# Altium schematic sheet 28.SchDoc
size 513 x 386 mm
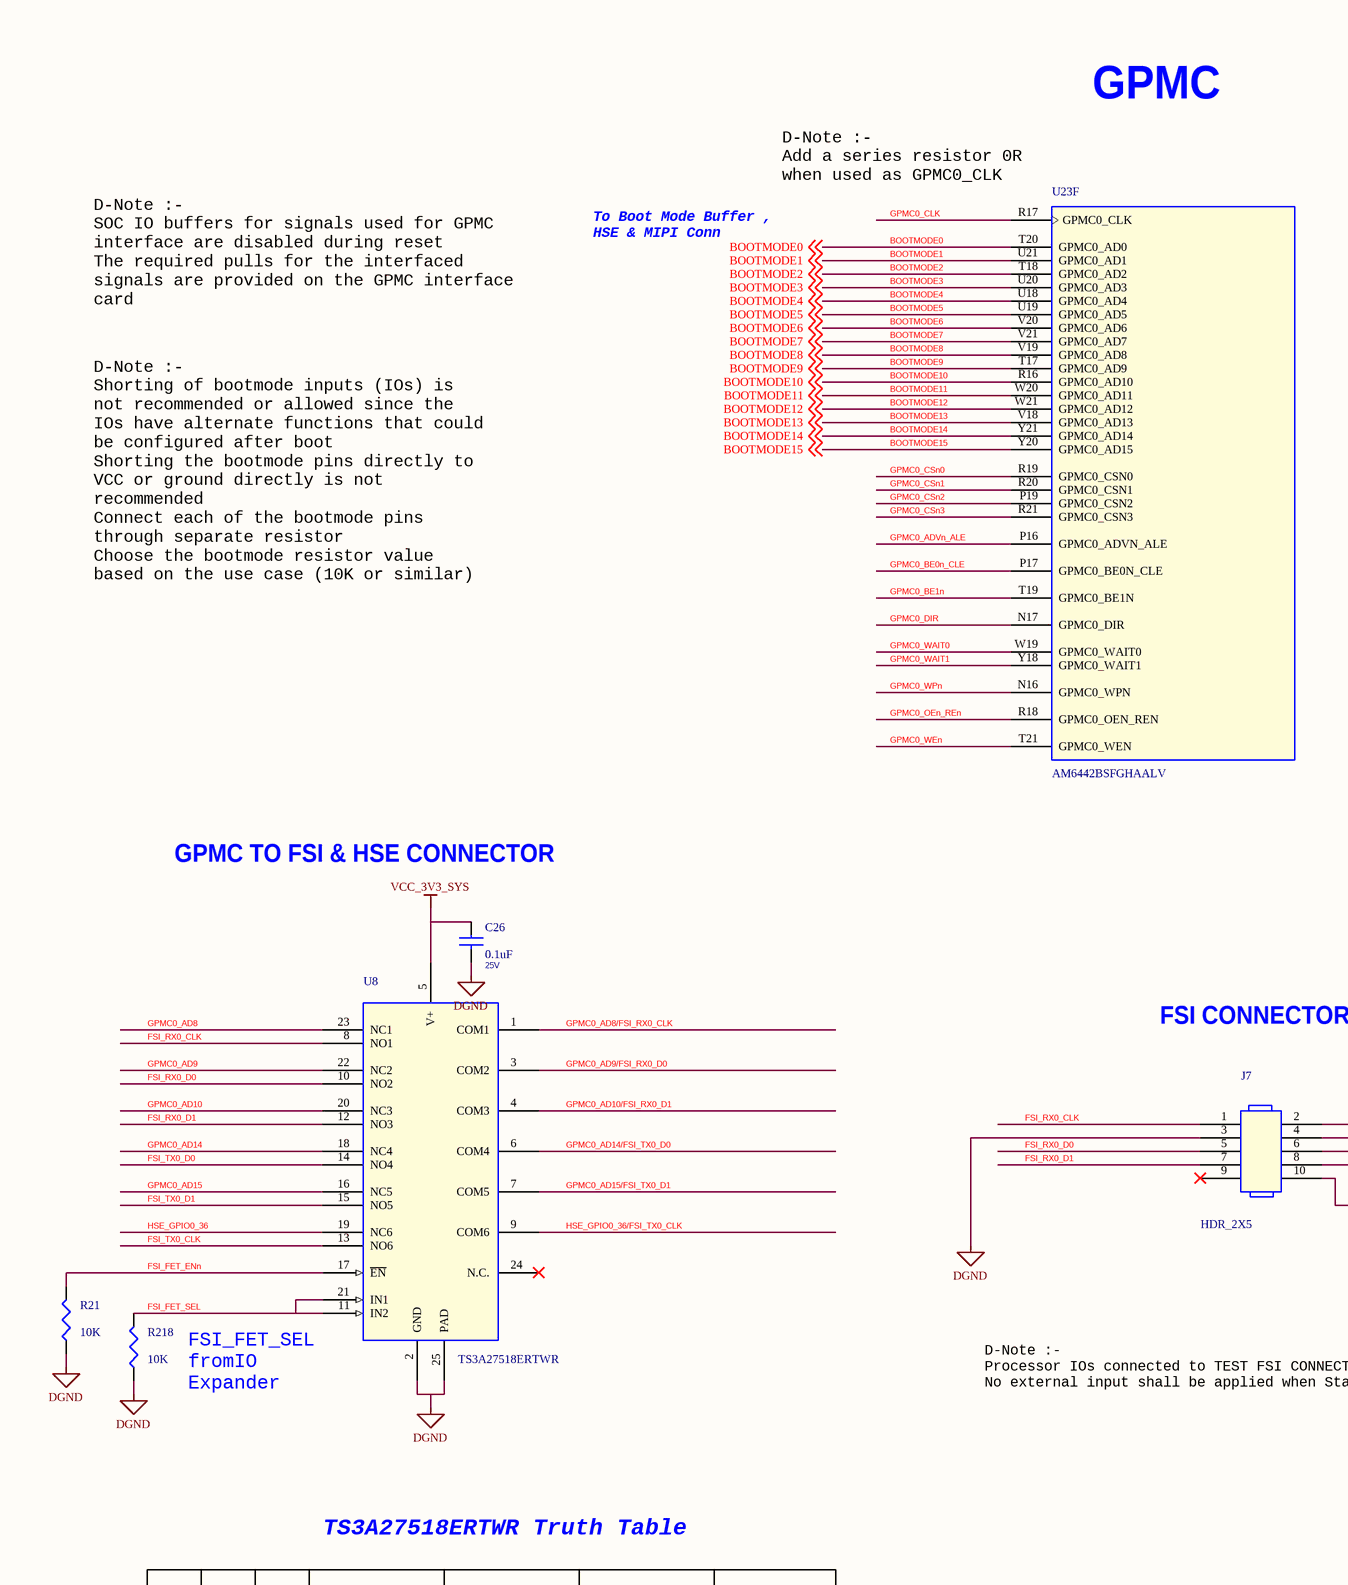
[diagram p0: 28.SchDoc, top left]
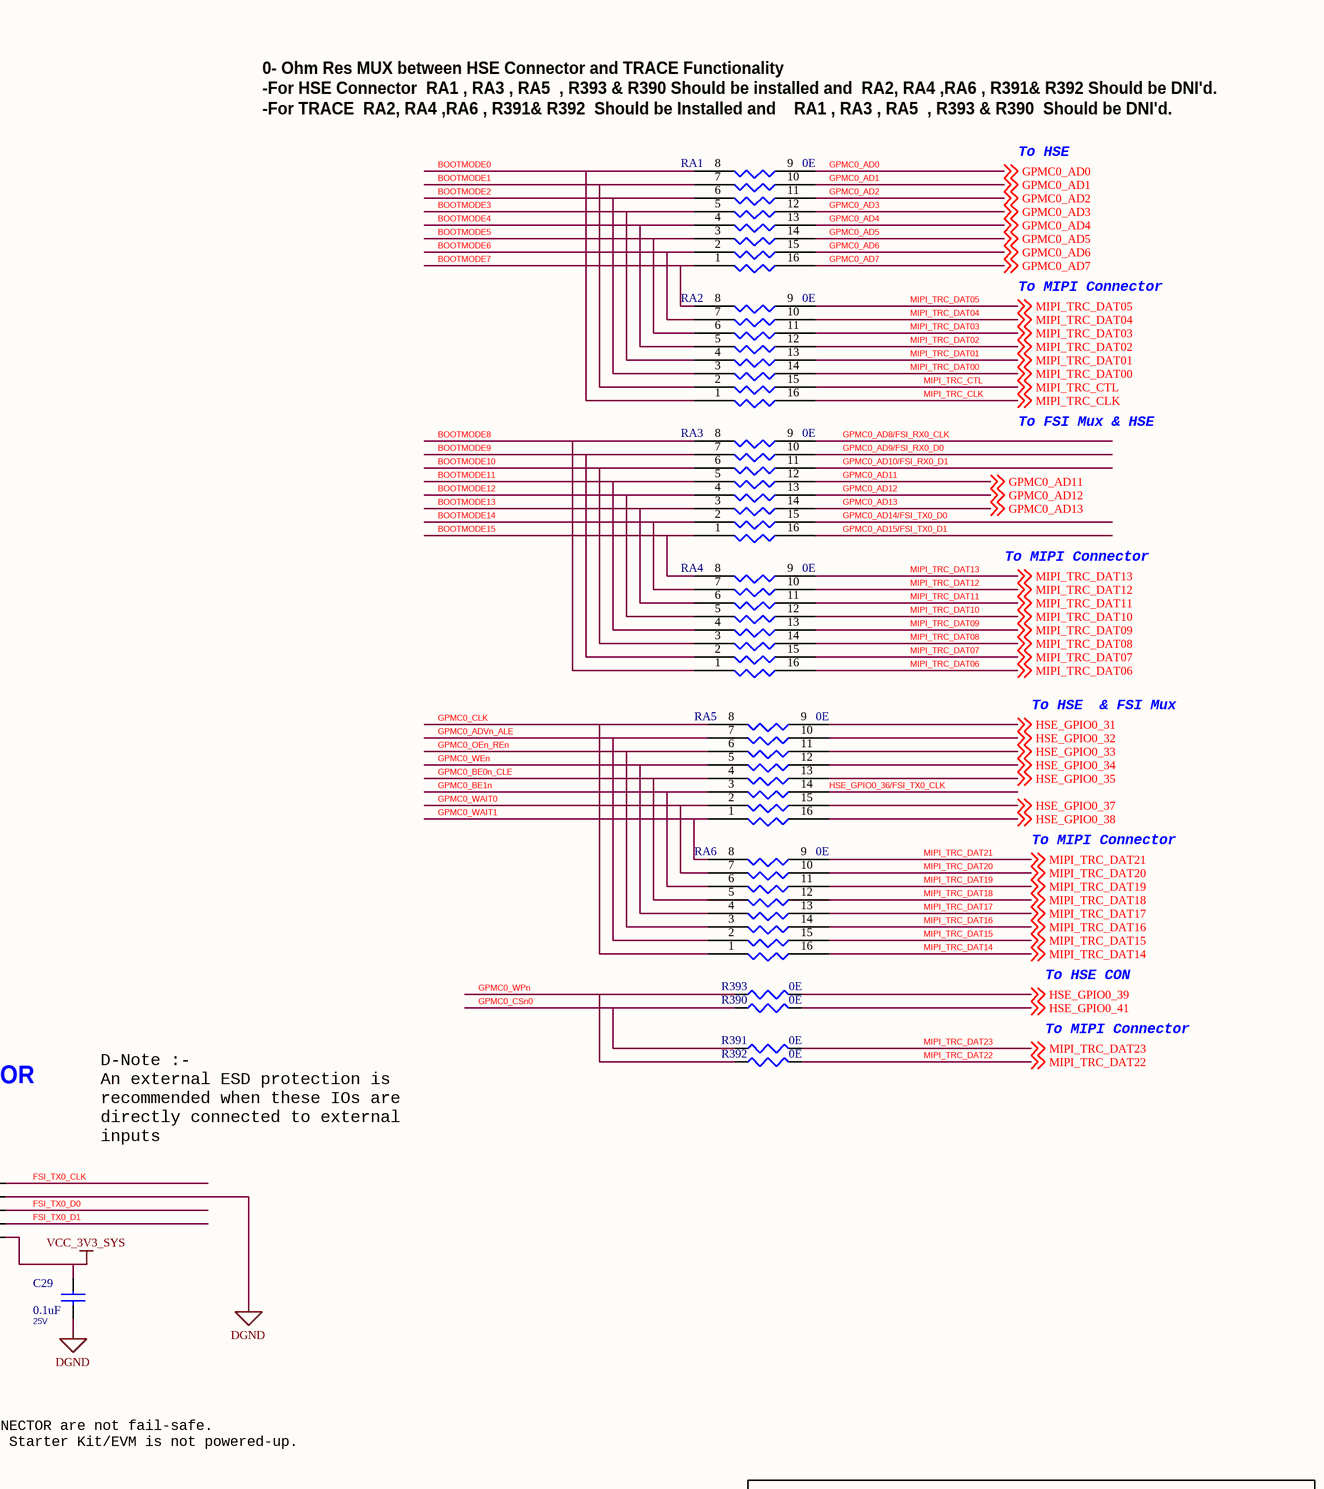
[diagram p1: 28.SchDoc, top right]
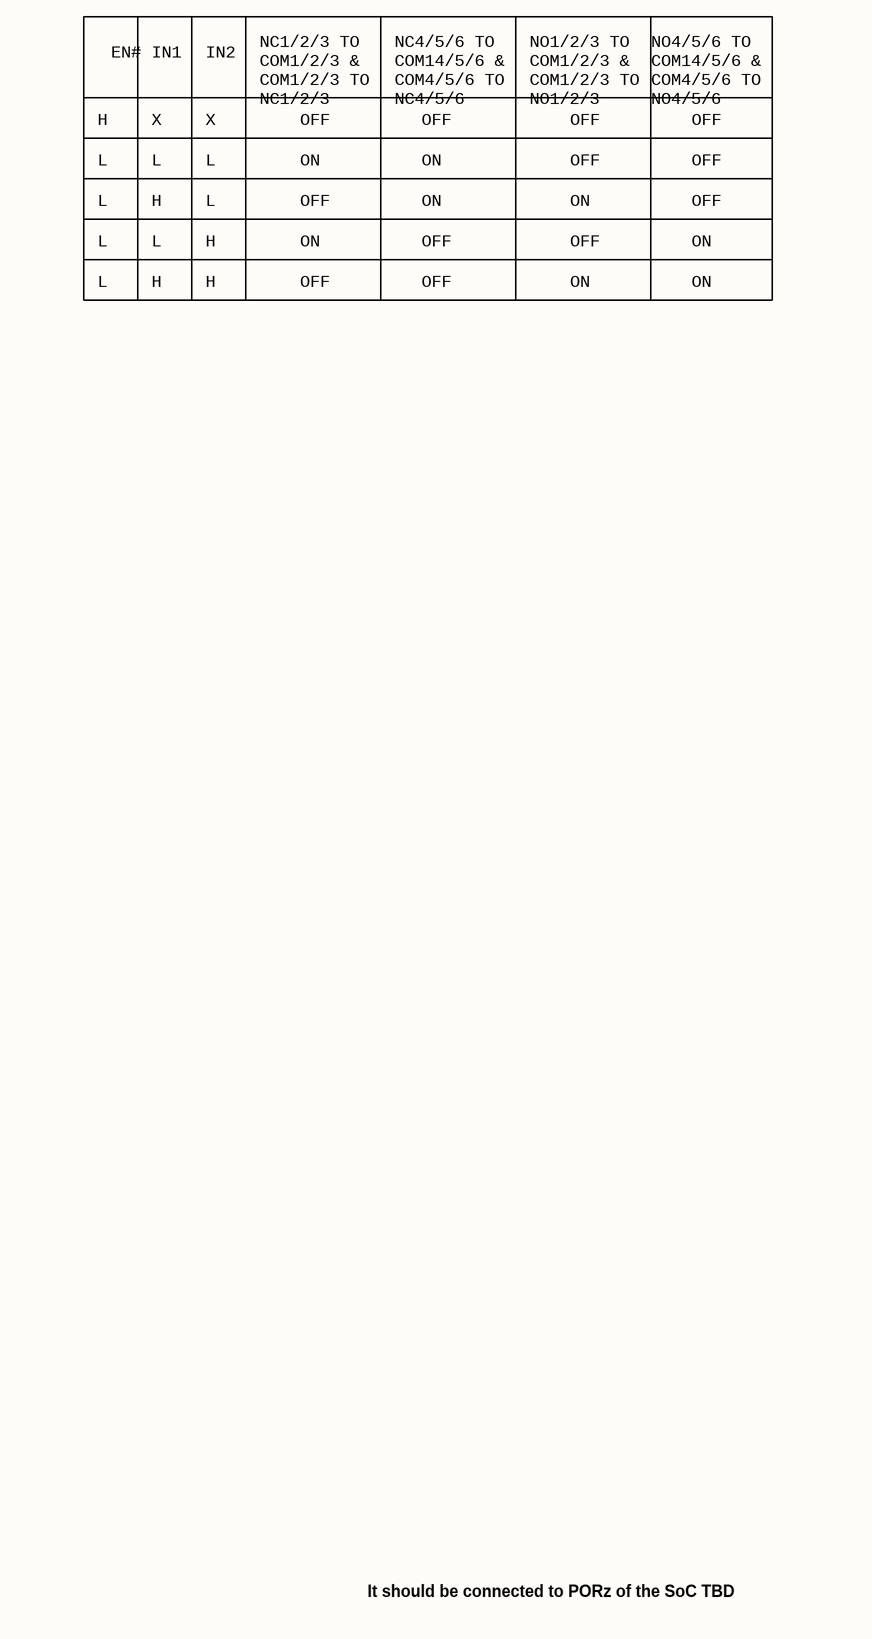
[diagram p2: 28.SchDoc, bottom left]
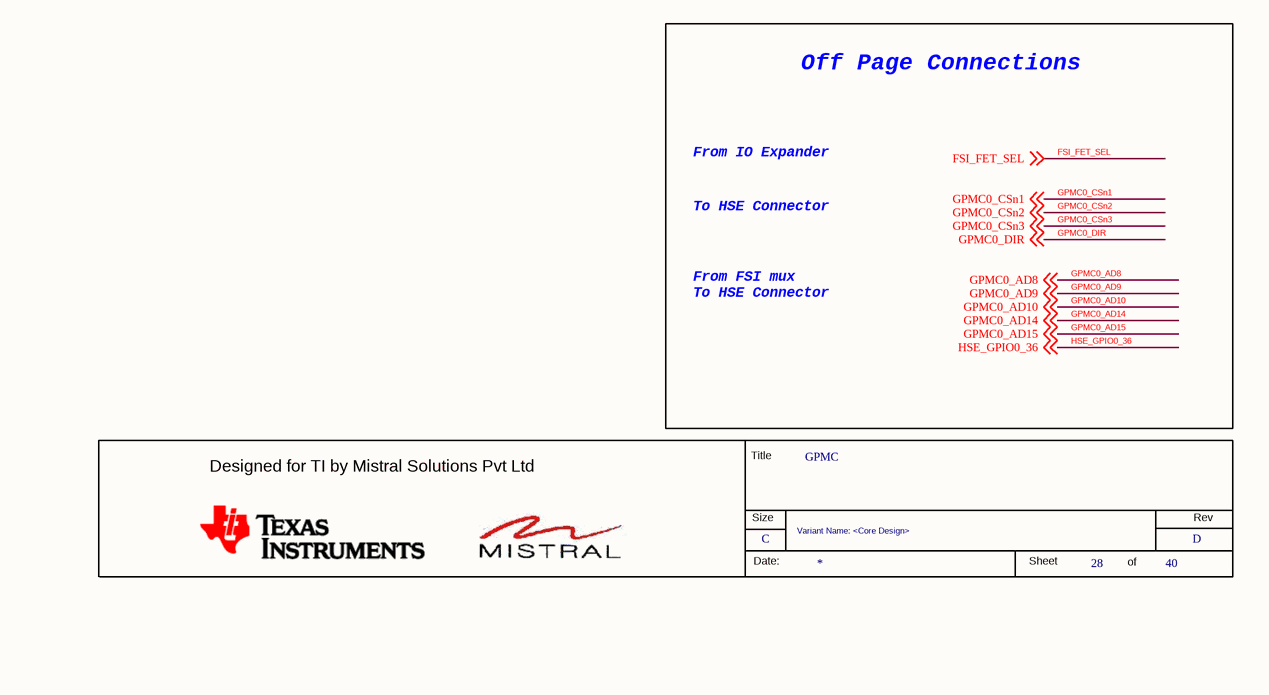
[diagram p3: 28.SchDoc, bottom right]

## Parts
*  RevCode: D  Title: GPMC  Page Size: C  Page Number: 28  Page Count: 40  Variant Name: <Core Design>  (hidden comment: MISTRAL_TITLEBLK_CSIZE)  (graphical)
C26  0.1uF  Voltage: 25V  [CAP0402_0-75]
C29  0.1uF  Voltage: 25V  [CAP0402_0-75]
J7  HDR_2X5  [HDR_5X2_100_S_T_8-6]
R21  10K  [RES0402_0-5]
R218  10K  [RES0402_0-5]
R390  0E  [RES0402_0-5]
R391  0E  [RES0402_0-5]
R392  0E  [RES0402_0-5]
R393  0E  [RES0402_0-5]
RA1  0E  [RESA_EXB2HV_0602-8_0-6]
RA2  0E  [RESA_EXB2HV_0602-8_0-6]
RA3  0E  [RESA_EXB2HV_0602-8_0-6]
RA4  0E  [RESA_EXB2HV_0602-8_0-6]
RA5  0E  [RESA_EXB2HV_0602-8_0-6]
RA6  0E  [RESA_EXB2HV_0602-8_0-6]
U8  TS3A27518ERTWR  [QFN24_19-68_160X160_0-8]
U23  AM6442BSFGHAALV  [FCBGA441_31-49_680X680_2-6]  (part F of 16)

## Nets
DGND: C26.2 C29.2 J7.3 J7.4 R21.2 R218.2 U8.2(GND) U8.25(PAD)
VCC_3V3_SYS: C26.1 C29.1 J7.10 U8.5(V+)
BOOTMODE0: RA1.8 RA2.1 U23.T20(GPMC0_AD0) ; off-sheet BOOTMODE0
BOOTMODE1: RA1.7 RA2.2 U23.U21(GPMC0_AD1) ; off-sheet BOOTMODE1
BOOTMODE2: RA1.6 RA2.3 U23.T18(GPMC0_AD2) ; off-sheet BOOTMODE2
BOOTMODE3: RA1.5 RA2.4 U23.U20(GPMC0_AD3) ; off-sheet BOOTMODE3
BOOTMODE4: RA1.4 RA2.5 U23.U18(GPMC0_AD4) ; off-sheet BOOTMODE4
BOOTMODE5: RA1.3 RA2.6 U23.U19(GPMC0_AD5) ; off-sheet BOOTMODE5
BOOTMODE6: RA1.2 RA2.7 U23.V20(GPMC0_AD6) ; off-sheet BOOTMODE6
BOOTMODE7: RA1.1 RA2.8 U23.V21(GPMC0_AD7) ; off-sheet BOOTMODE7
BOOTMODE8: RA3.8 RA4.1 U23.V19(GPMC0_AD8) ; off-sheet BOOTMODE8
BOOTMODE9: RA3.7 RA4.2 U23.T17(GPMC0_AD9) ; off-sheet BOOTMODE9
BOOTMODE10: RA3.6 RA4.3 U23.R16(GPMC0_AD10) ; off-sheet BOOTMODE10
BOOTMODE11: RA3.5 RA4.4 U23.W20(GPMC0_AD11) ; off-sheet BOOTMODE11
BOOTMODE12: RA3.4 RA4.5 U23.W21(GPMC0_AD12) ; off-sheet BOOTMODE12
BOOTMODE13: RA3.3 RA4.6 U23.V18(GPMC0_AD13) ; off-sheet BOOTMODE13
BOOTMODE14: RA3.2 RA4.7 U23.Y21(GPMC0_AD14) ; off-sheet BOOTMODE14
BOOTMODE15: RA3.1 RA4.8 U23.Y20(GPMC0_AD15) ; off-sheet BOOTMODE15
FSI_FET_ENn: R21.1 U8.17(~{EN})
FSI_FET_SEL: R218.1 U8.11(IN2) U8.21(IN1) ; off-sheet FSI_FET_SEL
FSI_RX0_CLK: J7.1 U8.8(NO1)
FSI_RX0_D0: J7.5 U8.10(NO2)
FSI_RX0_D1: J7.7 U8.12(NO3)
FSI_TX0_CLK: J7.2 U8.13(NO6)
FSI_TX0_D0: J7.6 U8.14(NO4)
FSI_TX0_D1: J7.8 U8.15(NO5)
GPMC0_AD0: RA1.9 ; off-sheet GPMC0_AD0
GPMC0_AD1: RA1.10 ; off-sheet GPMC0_AD1
GPMC0_AD2: RA1.11 ; off-sheet GPMC0_AD2
GPMC0_AD3: RA1.12 ; off-sheet GPMC0_AD3
GPMC0_AD4: RA1.13 ; off-sheet GPMC0_AD4
GPMC0_AD5: RA1.14 ; off-sheet GPMC0_AD5
GPMC0_AD6: RA1.15 ; off-sheet GPMC0_AD6
GPMC0_AD7: RA1.16 ; off-sheet GPMC0_AD7
GPMC0_AD8: U8.23(NC1) ; off-sheet GPMC0_AD8
GPMC0_AD8/FSI_RX0_CLK: RA3.9 U8.1(COM1)
GPMC0_AD9: U8.22(NC2) ; off-sheet GPMC0_AD9
GPMC0_AD9/FSI_RX0_D0: RA3.10 U8.3(COM2)
GPMC0_AD10: U8.20(NC3) ; off-sheet GPMC0_AD10
GPMC0_AD10/FSI_RX0_D1: RA3.11 U8.4(COM3)
GPMC0_AD11: RA3.12 ; off-sheet GPMC0_AD11
GPMC0_AD12: RA3.13 ; off-sheet GPMC0_AD12
GPMC0_AD13: RA3.14 ; off-sheet GPMC0_AD13
GPMC0_AD14: U8.18(NC4) ; off-sheet GPMC0_AD14
GPMC0_AD14/FSI_TX0_D0: RA3.15 U8.6(COM4)
GPMC0_AD15: U8.16(NC5) ; off-sheet GPMC0_AD15
GPMC0_AD15/FSI_TX0_D1: RA3.16 U8.7(COM5)
GPMC0_ADVn_ALE: RA5.7 RA6.2 U23.P16(GPMC0_ADVN_ALE)
GPMC0_BE0n_CLE: RA5.4 RA6.5 U23.P17(GPMC0_BE0N_CLE)
GPMC0_BE1n: RA5.3 RA6.6 U23.T19(GPMC0_BE1N)
GPMC0_CLK: RA5.8 RA6.1 U23.R17(GPMC0_CLK)
GPMC0_CSn0: R390.1 R391.1 U23.R19(GPMC0_CSN0)
GPMC0_CSn1: U23.R20(GPMC0_CSN1) ; off-sheet GPMC0_CSn1
GPMC0_CSn2: U23.P19(GPMC0_CSN2) ; off-sheet GPMC0_CSn2
GPMC0_CSn3: U23.R21(GPMC0_CSN3) ; off-sheet GPMC0_CSn3
GPMC0_DIR: U23.N17(GPMC0_DIR) ; off-sheet GPMC0_DIR
GPMC0_OEn_REn: RA5.6 RA6.3 U23.R18(GPMC0_OEN_REN)
GPMC0_WAIT0: RA5.2 RA6.7 U23.W19(GPMC0_WAIT0)
GPMC0_WAIT1: RA5.1 RA6.8 U23.Y18(GPMC0_WAIT1)
GPMC0_WEn: RA5.5 RA6.4 U23.T21(GPMC0_WEN)
GPMC0_WPn: R392.1 R393.1 U23.N16(GPMC0_WPN)
HSE_GPIO0_31: RA5.9 ; off-sheet HSE_GPIO0_31
HSE_GPIO0_32: RA5.10 ; off-sheet HSE_GPIO0_32
HSE_GPIO0_33: RA5.11 ; off-sheet HSE_GPIO0_33
HSE_GPIO0_34: RA5.12 ; off-sheet HSE_GPIO0_34
HSE_GPIO0_35: RA5.13 ; off-sheet HSE_GPIO0_35
HSE_GPIO0_36: U8.19(NC6) ; off-sheet HSE_GPIO0_36
HSE_GPIO0_36/FSI_TX0_CLK: RA5.14 U8.9(COM6)
HSE_GPIO0_37: RA5.15 ; off-sheet HSE_GPIO0_37
HSE_GPIO0_38: RA5.16 ; off-sheet HSE_GPIO0_38
HSE_GPIO0_39: R393.2 ; off-sheet HSE_GPIO0_39
HSE_GPIO0_41: R390.2 ; off-sheet HSE_GPIO0_41
MIPI_TRC_CLK: RA2.16 ; off-sheet MIPI_TRC_CLK
MIPI_TRC_CTL: RA2.15 ; off-sheet MIPI_TRC_CTL
MIPI_TRC_DAT00: RA2.14 ; off-sheet MIPI_TRC_DAT00
MIPI_TRC_DAT01: RA2.13 ; off-sheet MIPI_TRC_DAT01
MIPI_TRC_DAT02: RA2.12 ; off-sheet MIPI_TRC_DAT02
MIPI_TRC_DAT03: RA2.11 ; off-sheet MIPI_TRC_DAT03
MIPI_TRC_DAT04: RA2.10 ; off-sheet MIPI_TRC_DAT04
MIPI_TRC_DAT05: RA2.9 ; off-sheet MIPI_TRC_DAT05
MIPI_TRC_DAT06: RA4.16 ; off-sheet MIPI_TRC_DAT06
MIPI_TRC_DAT07: RA4.15 ; off-sheet MIPI_TRC_DAT07
MIPI_TRC_DAT08: RA4.14 ; off-sheet MIPI_TRC_DAT08
MIPI_TRC_DAT09: RA4.13 ; off-sheet MIPI_TRC_DAT09
MIPI_TRC_DAT10: RA4.12 ; off-sheet MIPI_TRC_DAT10
MIPI_TRC_DAT11: RA4.11 ; off-sheet MIPI_TRC_DAT11
MIPI_TRC_DAT12: RA4.10 ; off-sheet MIPI_TRC_DAT12
MIPI_TRC_DAT13: RA4.9 ; off-sheet MIPI_TRC_DAT13
MIPI_TRC_DAT14: RA6.16 ; off-sheet MIPI_TRC_DAT14
MIPI_TRC_DAT15: RA6.15 ; off-sheet MIPI_TRC_DAT15
MIPI_TRC_DAT16: RA6.14 ; off-sheet MIPI_TRC_DAT16
MIPI_TRC_DAT17: RA6.13 ; off-sheet MIPI_TRC_DAT17
MIPI_TRC_DAT18: RA6.12 ; off-sheet MIPI_TRC_DAT18
MIPI_TRC_DAT19: RA6.11 ; off-sheet MIPI_TRC_DAT19
MIPI_TRC_DAT20: RA6.10 ; off-sheet MIPI_TRC_DAT20
MIPI_TRC_DAT21: RA6.9 ; off-sheet MIPI_TRC_DAT21
MIPI_TRC_DAT22: R392.2 ; off-sheet MIPI_TRC_DAT22
MIPI_TRC_DAT23: R391.2 ; off-sheet MIPI_TRC_DAT23

Not connected (* = marked no-connect by the designer): J7 9*; U8 24(N.C.)*

## Notes on the sheet
- 0- Ohm Res MUX between HSE Connector and TRACE Functionality
  -For HSE Connector  RA1 , RA3 , RA5  , R393 & R390 Should be installed and  RA2, RA4 ,RA6 , R391& R392 Should be DNI'd.
  -For TRACE  RA2, RA4 ,RA6 , R391& R392  Should be Installed and    RA1 , RA3 , RA5  , R393 & R390  Should be DNI'd.
- (near U23) D-Note :-
  Add a series resistor 0R
  when used as GPMC0_CLK
- GPMC
- To HSE
- D-Note :-
  SOC IO buffers for signals used for GPMC
  interface are disabled during reset
  The required pulls for the interfaced
  signals are provided on the GPMC interface
  card
- To Boot Mode Buffer ,
  HSE & MIPI Conn
- To MIPI Connector
- D-Note :-
  Shorting of bootmode inputs (IOs) is
  not recommended or allowed since the
  IOs have alternate functions that could
  be configured after boot
  Shorting the bootmode pins directly to
  VCC or ground directly is not
  recommended
  Connect each of the bootmode pins
  through separate resistor
  Choose the bootmode resistor value
  based on the use case (10K or similar)
- To FSI Mux & HSE
- To HSE  & FSI Mux
- GPMC TO FSI & HSE CONNECTOR
- To HSE CON
- D-Note :-
  An external ESD protection is
  recommended when these IOs are
  directly connected to external
  inputs
- FSI CONNECTOR
- (near U8) FSI_FET_SEL
  fromIO
  Expander
- D-Note :-
  Processor IOs connected to TEST FSI CONNECTOR are not fail-safe.
  No external input shall be applied when Starter Kit/EVM is not powered-up.
- Off Page Connections
- TS3A27518ERTWR Truth Table
- EN#
- IN1
- IN2
- NC1/2/3 TO
  COM1/2/3 &
  COM1/2/3 TO
  NC1/2/3
- NC4/5/6 TO
  COM14/5/6 &
  COM4/5/6 TO
  NC4/5/6
- NO1/2/3 TO
  COM1/2/3 &
  COM1/2/3 TO
  NO1/2/3
- NO4/5/6 TO
  COM14/5/6 &
  COM4/5/6 TO
  NO4/5/6
- To HSE Connector
- From IO Expander
- H
- X
- OFF
- From FSI mux
  To HSE Connector
- L
- ON
- It should be connected to PORz of the SoC TBD
- (in symbol MISTRAL_TITLEBLK_CSIZE) Title; Designed for TI by Mistral Solutions Pvt Ltd; Size; Rev; Date:; Sheet; of

## Library data of the parts
* = MISTRAL_TITLEBLK_CSIZE: Issue: 1.0; Page Create Date: March  8, 1995; Page Modify Date: *
C26 C29 = CAP_Dup3: CAP CERAMIC 0.1uF 25V 20% X5R 0402; Alt_Mfr_name: YAGEO AMERICA; Part_type: CAPACITORS\CERAMIC; Mfr_part_number: 885012105018; Mfr_name: WURTH ELECTRONICS; Mistral Part No: 120020080003-R; Alt_Mfr_part_number: CC0402KRX5R8BB104; Custom_Duty: 15%; Customs_HS_Code: 85322990; Wattage: NA; Project: AM64x_EVM_BRD; PCB Footprint: CAP0402_0-75; Footprint Path: Y:\MIS_DATABASE\Library\ALTIUM_TOOL\PCB_FOOTPRINTS\Altium_Footprint_Lib.PcbLib; Library Path: Y:\MIS_DATABASE\Library\ALTIUM_TOOL\SCHEMATICS_PARTS\MS_DISCRETE_Library.schlib; Footprint Ref: CAP0402_0-75; Library Ref: CAP; MECHANICAL 3D STEP FILE: CAP0402_0-75; Chkd/date: MANIRAJA/170820; Crtd /date: ALVY/170820; Datasheet: Y:\MIS_DATABASE\DATASHEETS\CAPACITORS\885012105018.PDF; Temperature: -55癈+85癈; Weight: 0.65mg; Height: 0.55MM; Distributor_part_number: 732-7495-1-ND; Distributor_name: DIGIKEY; Package: 0402; Tolerance: 20%
J7 = HEADER_5X2: CON HDR 2X5 2.54MM PITCH ST TH; Part_type: CONNECTOR\HEADERS; Mfr_part_number: 67997-410HLF; Mfr_name: FCI; Mistral Part No: 150015100040-R; Custom_Duty: 24%; Customs_HS_Code: 85369090; Wattage: NA; Project: CYPHY_ROADKILL; PCB Footprint: HDR_5X2_100_S_T_8-6; MECHANICAL 3D STEP FILE: HDR_5X2_100_S_T_8-6; Chkd/date: VASANTHA/220317; Crtd /date: MANIRAJA/210317; Datasheet: Y:\MIS_DATABASE\DATASHEETS\CONNECTORS\67997.PDF; Temperature: NA; Weight: NA; Height: 8.58MM; Library Ref: HEADER_5X2; Distributor_part_number: 609-3243-ND; Distributor_name: DIGIKEY; Package: THRU-HOLE; Voltage: NA; Tolerance: NA
R21 R218 = RESISTOR_Dup6: RES 10K 1/16W 5% 0402; Part_type: RESISTORS\FIXED; Mfr_part_number: RC0402JR-0710KL; Mfr_name: YAGEO AMERICA; Mistral Part No: 110011060021-R; Custom_Duty: 15%; Customs_HS_Code: 85332119; Voltage: NA; Project: HSE; PCB Footprint: RES0402_0-5; Footprint Path: Y:\MIS_DATABASE\Library\ALTIUM_TOOL\PCB_FOOTPRINTS\Altium_Footprint_Lib.PcbLib; Library Path: Y:\MIS_DATABASE\Library\ALTIUM_TOOL\SCHEMATICS_PARTS\MS_DISCRETE_Library.schlib; Footprint Ref: RES0402_0-5; Library Ref: RESISTOR; MECHANICAL 3D STEP FILE: RES0402_0-5; Chkd/date: VASANTHA/061216; Crtd /date: MAZHAR/230805; Datasheet: Y:\MIS_DATABASE\DATASHEETS\RESISTORS\RCXXXXL-SER_MAR18.PDF; Temperature: -55癈+155癈; Weight: 0.65mg; Height: 0.40MM; Distributor_part_number: 311-10KJRCT-ND; Distributor_name: DIGIKEY; Package: 0402; Wattage: 1/16W; Tolerance: 5%
R390-R392 = RESISTOR_Dup5: RES 0E 1/16W JUMPER 0402; Part_type: RESISTORS\FIXED; Mfr_part_number: CRCW04020000Z0ED; Mfr_name: VISHAY; Mistral Part No: 110010080019-R; Custom_Duty: 15%; Customs_HS_Code: 85332119; Voltage: NA; Project: PB_BUGBASE; PCB Footprint: RES0402_0-5; Chkd/date: VASANTHA/201216; Crtd /date: MUDDU/190810; Datasheet: Y:\MIS_DATABASE\DATASHEETS\RESISTORS\CRCW0603.PDF; Temperature: -55癈+155癈; Weight: 0.65mg; Height: 0.40MM; Distributor_part_number: 541-0.0JCT-ND; Distributor_name: DIGIKEY; Package: 0402; Wattage: 1/16W; Tolerance: NA; MECHANICAL 3D STEP FILE: RES0402_0-5; SIGNAL_MODEL: RES; Library Ref: RESISTOR; Footprint Ref: RES0402_0-5; Library Path: Y:\MIS_DATABASE\Library\ALTIUM_TOOL\SCHEMATICS_PARTS\MS_DISCRETE_Library.schlib; Footprint Path: Y:\MIS_DATABASE\Library\ALTIUM_TOOL\PCB_FOOTPRINTS\Altium_Footprint_Lib.PcbLib
R393 = RESISTOR_Dup5: RES 0E 1/16W JUMPER 0402; Mistral Part No: 110010080019-R; Mfr_name: VISHAY; Mfr_part_number: CRCW04020000Z0ED; Part_type: RESISTORS\FIXED; Project: PB_BUGBASE; Tolerance: NA; Customs_HS_Code: 85332119; Custom_Duty: 15%; PCB Footprint: RES0402_0-5; Voltage: NA; Wattage: 1/16W; Package: 0402; Distributor_name: DIGIKEY; Distributor_part_number: 541-0.0JCT-ND; Height: 0.40MM; Weight: 0.65mg; Temperature: -55癈+155癈; Datasheet: Y:\MIS_DATABASE\DATASHEETS\RESISTORS\CRCW0603.PDF; Crtd /date: MUDDU/190810; Chkd/date: VASANTHA/201216; MECHANICAL 3D STEP FILE: RES0402_0-5; SIGNAL_MODEL: RES; Library Ref: RESISTOR; Footprint Ref: RES0402_0-5; Library Path: Y:\MIS_DATABASE\Library\ALTIUM_TOOL\SCHEMATICS_PARTS\MS_DISCRETE_Library.schlib; Footprint Path: Y:\MIS_DATABASE\Library\ALTIUM_TOOL\PCB_FOOTPRINTS\Altium_Footprint_Lib.PcbLib
RA1 RA4 RA5 = RESARR_ISO8_0402: RES ARRAY 0E 1/16W JUMPER 0602-8; Part_type: RESISTORS\ARRAY; Mfr_part_number: EXB-2HVR000V; Mfr_name: PANASONIC-ECG; Mistral Part No: 110009030004-R; Custom_Duty: 15%; Customs_HS_Code: 85332119; Voltage: NA; Project: V12SFP; SIGNAL_MODEL: RESA; PCB Footprint: RESA_EXB2HV_0602-8_0-6; Footprint Path: Y:\MIS_DATABASE\Library\ALTIUM_TOOL\PCB_FOOTPRINTS\Altium_Footprint_Lib.PcbLib; Library Path: Y:\MIS_DATABASE\Library\ALTIUM_TOOL\SCHEMATICS_PARTS\MS_DISCRETE_Library.schlib; MECHANICAL 3D STEP FILE: RESA_EXB2HV_0602-8_0-6; Temperature: -55癈+125癈; Weight: 9mg; Wattage: 1/16W; Tolerance: NA; Footprint Ref: RESA_EXB2HV_0602-8_0-6; Chkd/date: SHREESHAIL/121205; Crtd /date: MAZHAR/300505; Datasheet: Y:\MIS_DATABASE\DATASHEETS\RESISTORS\EXB-18V.PDF; Height: 0.55MM; Distributor_part_number: Y1000CT-ND; Distributor_name: DIGIKEY; Package: 0602-8; Library Ref: RESARR_ISO8_0402
RA2 RA3 = RESARR_ISO8_0402: RES ARRAY 0E 1/16W JUMPER 0602-8; Mistral Part No: 110009030004-R; Mfr_name: PANASONIC-ECG; Mfr_part_number: EXB-2HVR000V; Part_type: RESISTORS\ARRAY; Custom_Duty: 15%; Customs_HS_Code: 85332119; Voltage: NA; SIGNAL_MODEL: RESA; Project: V12SFP; PCB Footprint: RESA_EXB2HV_0602-8_0-6; Footprint Path: Y:\MIS_DATABASE\Library\ALTIUM_TOOL\PCB_FOOTPRINTS\Altium_Footprint_Lib.PcbLib; Library Path: Y:\MIS_DATABASE\Library\ALTIUM_TOOL\SCHEMATICS_PARTS\MS_DISCRETE_Library.schlib; MECHANICAL 3D STEP FILE: RESA_EXB2HV_0602-8_0-6; Temperature: -55癈+125癈; Weight: 9mg; Wattage: 1/16W; Tolerance: NA; Footprint Ref: RESA_EXB2HV_0602-8_0-6; Library Ref: RESARR_ISO8_0402; Package: 0602-8; Distributor_name: DIGIKEY; Distributor_part_number: Y1000CT-ND; Height: 0.55MM; Datasheet: Y:\MIS_DATABASE\DATASHEETS\RESISTORS\EXB-18V.PDF; Crtd /date: MAZHAR/300505; Chkd/date: SHREESHAIL/121205
RA6 = RESARR_ISO8_0402: RES ARRAY 0E 1/16W JUMPER 0602-8; Mistral Part No: 110009030004-R; Mfr_name: PANASONIC-ECG; Mfr_part_number: EXB-2HVR000V; Part_type: RESISTORS\ARRAY; SIGNAL_MODEL: RESA; Project: V12SFP; Tolerance: NA; Customs_HS_Code: 85332119; Custom_Duty: 15%; PCB Footprint: RESA_EXB2HV_0602-8_0-6; Library Ref: RESARR_ISO8_0402; Package: 0602-8; Distributor_name: DIGIKEY; Distributor_part_number: Y1000CT-ND; Height: 0.55MM; Datasheet: Y:\MIS_DATABASE\DATASHEETS\RESISTORS\EXB-18V.PDF; Crtd /date: MAZHAR/300505; Chkd/date: SHREESHAIL/121205; Footprint Ref: RESA_EXB2HV_0602-8_0-6; Voltage: NA; Wattage: 1/16W; Weight: 9mg; Temperature: -55癈+125癈; MECHANICAL 3D STEP FILE: RESA_EXB2HV_0602-8_0-6; Library Path: Y:\MIS_DATABASE\Library\ALTIUM_TOOL\SCHEMATICS_PARTS\MS_DISCRETE_Library.schlib; Footprint Path: Y:\MIS_DATABASE\Library\ALTIUM_TOOL\PCB_FOOTPRINTS\Altium_Footprint_Lib.PcbLib
U8 = TS3A27518ERTWR_QFN24: IC 6-BIT 1OF2 MULTIPLEXER/DEMULTIPLEXER WITH ESD & LCCI QFN24; Part_type: ICS\DIGITAL\COMBINATIONAL; Mfr_name: TEXAS INSTRUMENTS; Mistral Part No: 141009070012-R; Custom_Duty: 15%; Customs_HS_Code: 85423100; Wattage: NA; Project: BUG_BASE-II; PCB Footprint: QFN24_19-68_160X160_0-8; MECHANICAL 3D STEP FILE: QFN24_19-68_160X160_0-8; Chkd/date: MANIRAJA/111017; Crtd /date: USMAN/230709; Datasheet: Y:\MIS_DATABASE\DATASHEETS\ICS\DIGITAL\BUSTRANSCEIVER\TS3A27518E.PDF; Temperature: -40癈+85癈; Weight: NA; Height: 0.80MM; Library Ref: TS3A27518ERTWR_QFN24; Distributor_part_number: 296-25415-1-ND; Distributor_name: DIGIKEY; Package: QFN24; Voltage: NA; Tolerance: NA; Mfr_part_number: TS3A27518ERTWR
U23 = XAM6442BSFGGAALV_BGA441: IC AM64x SoC MICROPROCESSOR BGA441; Part_type: ICS\DIGITAL\MICROPROCESSOR; Mfr_name: TEXAS INSTRUMENTS; Mistral Part No: 141220080002; Custom_Duty: 15%; Customs_HS_Code: 85423100; Wattage: NA; Project: AM64x-GP_EVM BRD; Footprint Path: Y:\MIS_DATABASE\Library\ALTIUM_TOOL\PCB_FOOTPRINTS\Altium_Footprint_Lib.PcbLib; Library Path: Y:\MIS_DATABASE\Library\ALTIUM_TOOL\SCHEMATICS_PARTS\MS_MICROPROCESSOR_Library.schlib; MECHANICAL 3D STEP FILE: FCBGA441_31-49_680X680_2-6; RoHS: NA; Chkd/date: ALVY/300322; Crtd /date: ALVY/300322; Datasheet: Y:\MIS_DATABASE\DATASHEETS\ICS\DIGITAL\MICROCONTROLLER\AM64-SoC_SVB.PDF; Temperature: NA; Weight: NA; Height: 2.57MM; Library Ref: XAM6442BSFGGAALV_BGA441; Distributor_part_number: NA; Distributor_name: NA; Package: BGA441; Voltage: NA; Tolerance: NA; Mfr_part_number: AM6442BSFGHAALV; Footprint Ref: FCBGA441_31-49_680X680_2-6; PCB Footprint: FCBGA441_31-49_680X680_2-6